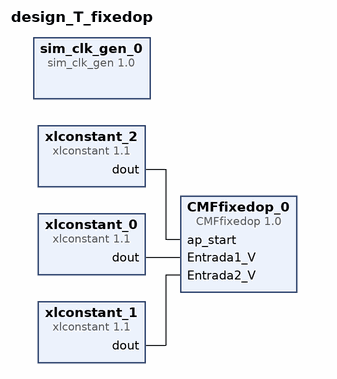
[diagram p0: block diagram of the top level]
# Vivado block design design_T_fixedop, xc7z020clg484-1, Vivado 2018.3
create_bd_design design_T_fixedop

create_bd_cell -type ip -vlnv xilinx.com:ip:sim_clk_gen:1.0 sim_clk_gen_0
set_property -dict {CONFIG.RESET_POLARITY ACTIVE_HIGH} [get_bd_cells sim_clk_gen_0]
create_bd_cell -type ip -vlnv xilinx.com:ip:xlconstant:1.1 xlconstant_0
set_property -dict {CONFIG.CONST_VAL 5 CONFIG.CONST_WIDTH 18} [get_bd_cells xlconstant_0]
create_bd_cell -type ip -vlnv xilinx.com:ip:xlconstant:1.1 xlconstant_1
set_property -dict {CONFIG.CONST_VAL 12 CONFIG.CONST_WIDTH 18} [get_bd_cells xlconstant_1]
create_bd_cell -type ip -vlnv xilinx.com:ip:xlconstant:1.1 xlconstant_2
set_property -dict {CONFIG.CONST_VAL 1 CONFIG.CONST_WIDTH 1} [get_bd_cells xlconstant_2]
create_bd_cell -type ip -vlnv xilinx.com:user:CMFfixedop:1.0 CMFfixedop_0

# ---- connections ----

connect_bd_net [get_bd_pins xlconstant_2/dout] [get_bd_pins CMFfixedop_0/ap_start]
connect_bd_net [get_bd_pins xlconstant_0/dout] [get_bd_pins CMFfixedop_0/Entrada1_V]
connect_bd_net [get_bd_pins xlconstant_1/dout] [get_bd_pins CMFfixedop_0/Entrada2_V]

validate_bd_design
save_bd_design
